# Altium schematic sheet Communication.SchDoc
size A4
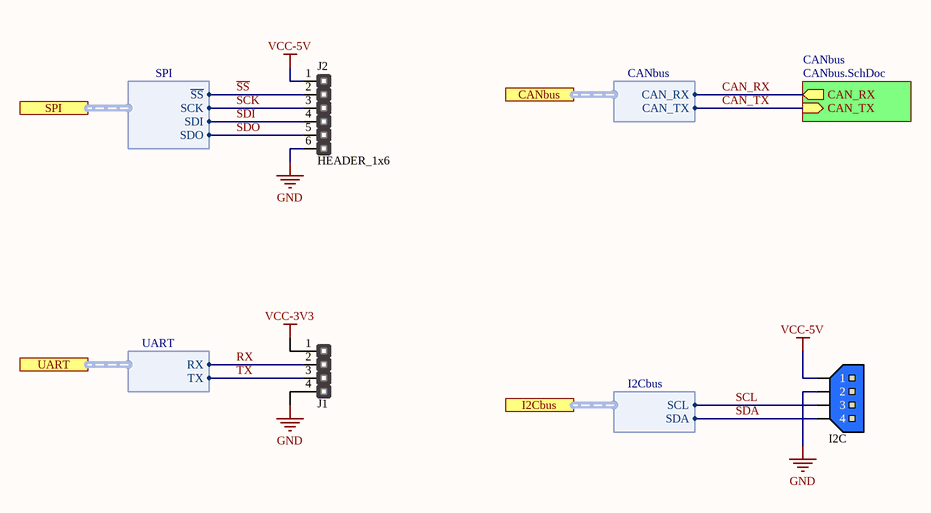
[diagram p0: Communication.SchDoc]

## Parts
I2C  TE CONNECTIVITY_4PIN_MALE  [TE CONNECTIVITY_4PIN_MALE]  (value not drawn)
J1  HEADER_1x4  [HM1X4]  (value not drawn)
J2  HEADER_1x6  [HM1X6]

## Sub-sheets
CANbus = CANbus.SchDoc: CAN_TX (in), CAN_RX (out)

## Ports
CANbus (harness CANbus), I2Cbus (harness I2Cbus), SPI (harness SPI), UART (harness UART)

## Harnesses
SPI: ~{SS}, SCK, SDI, SDO
UART: RX, TX
CANbus: CAN_RX, CAN_TX
I2Cbus: SCL, SDA

## Nets
GND: I2C.2 J1.4 J2.6
VCC-3V3: J1.1
VCC-5V: I2C.1 J2.1
CAN_RX: sheet CANbus/CAN_RX, port CANbus.CAN_RX
CAN_TX: sheet CANbus/CAN_TX, port CANbus.CAN_TX
RX: J1.2 ; port UART.RX
~{SS}: J2.2 ; port SPI.~{SS}
SCK: J2.3 ; port SPI.SCK
SCL: I2C.3 ; port I2Cbus.SCL
SDA: I2C.4 ; port I2Cbus.SDA
SDI: J2.4 ; port SPI.SDI
SDO: J2.5 ; port SPI.SDO
TX: J1.3 ; port UART.TX

## Library data of the parts
I2C = TE CONNECTIVITY_4PIN_MALE: BLUE_4PIN_CONECTOR; Manufacturer: TE CONNECTIVITY / AMP; Manufacturer Part Number 1: 281695-3; Order Code 1: 1205983; Price 1: L0.403; Supplier 1: uk.farnell.com